# EAGLE design phone-hub (EAGLE 5.06)
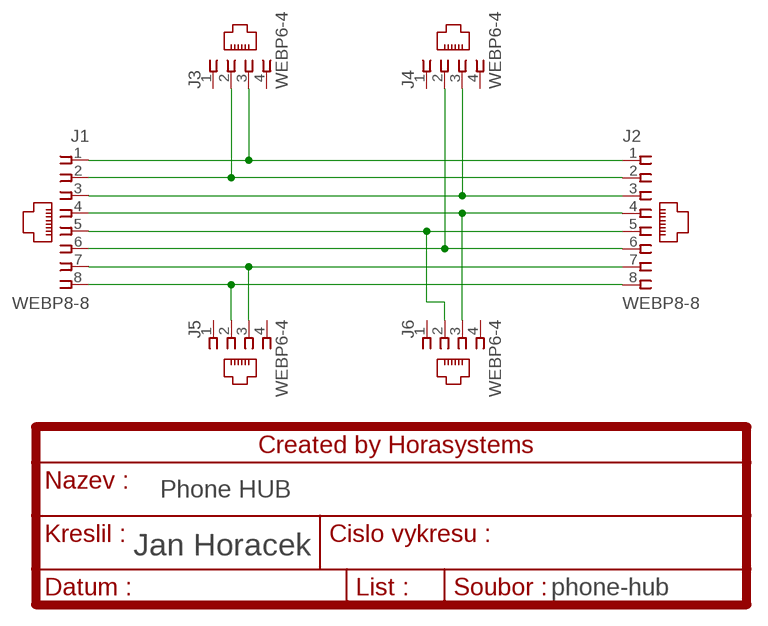
[diagram p0: schematic, sheet 1]

## Parts
J1  WEBP8-8  [WEBP8-8]
J2  WEBP8-8  [WEBP8-8]
J3  WEBP6-4  [WEBP6-4]
J4  WEBP6-4  [WEBP6-4]
J5  WEBP6-4  [WEBP6-4]
J6  WEBP6-4  [WEBP6-4]

## Nets
N$1: J1.1 J2.1 J3.3
N$2: J1.2 J2.2 J3.2
N$3: J1.3 J2.3 J4.3
N$4: J1.4 J2.4 J6.3
N$6: J1.6 J2.6 J4.2
N$7: J1.5 J2.5 J6.2
N$8: J1.8 J2.8 J5.2
N$9: J1.7 J2.7 J5.3
Unconnected: J3.1 J3.4 J4.1 J4.4 J5.1 J5.4 J6.1 J6.4

## Notes on the sheet
- Phone HUB

## Library data of the parts
J1 J2 = con-malina:WEBP8-8
J3-J6 = con-malina:WEBP6-4

## Board
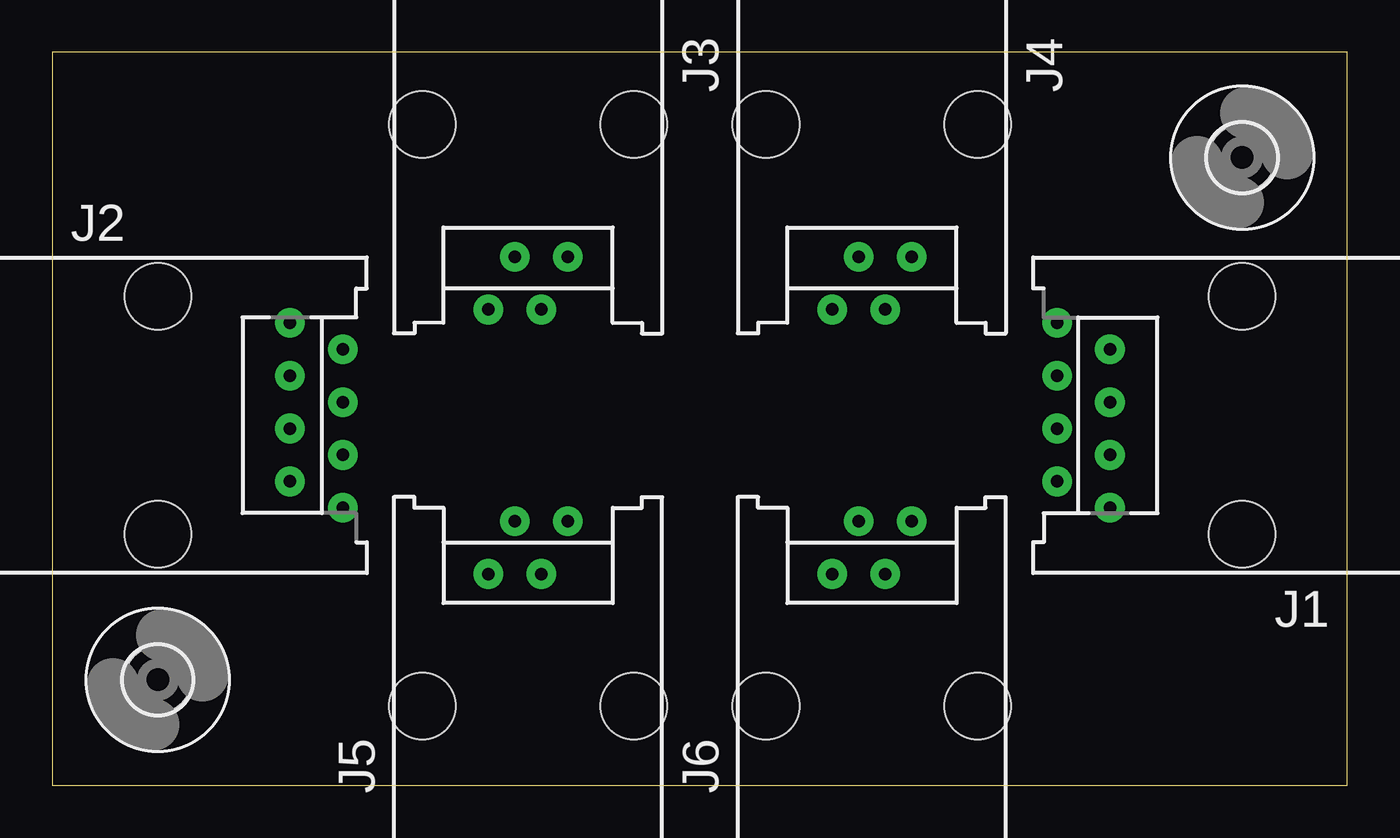
[diagram p1: board, top side]
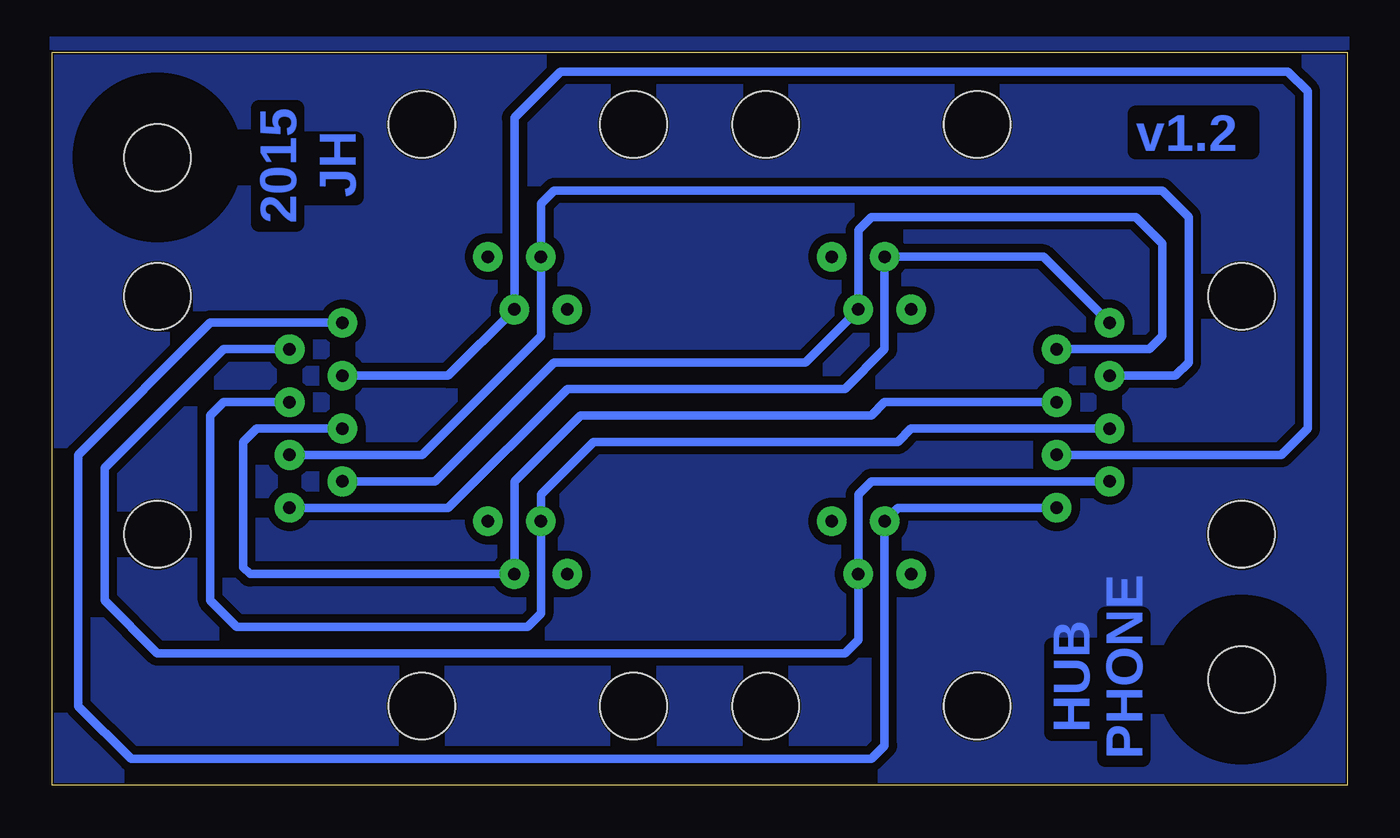
[diagram p2: board, bottom side, seen from below]

Size 62.21 x 35.23 mm. Coordinates in mm from the lower left corner, seen from the top.
Outline: 0,0 62.21,0 62.21,35.23 0,35.23 0,0
Copper layers (1*16): Top 0.036mm / dielectric 1.5011mm / Bottom 0.0356mm
Design rules "EBT_fotocesta_H *": minimum track width 0.3mm, minimum drill 0.6mm, track to track 0.4mm, track to pad 0.5mm, pad to pad 0.3mm, via to via 0.5mm, smd to smd 0mil, copper to edge 0.1mm, drill to drill 0.5mm, minimum pad ring 0.3mm, minimum via ring 0.4mm, stop-mask expansion 0mil, vias tented up to drill 0mil, thermal gap 1mm

### Footprints (pad centres in the part's own frame; a part is rotated, then mirrored left to right if it is on the bottom)
WEBP8-8 = drill 0.6 pad 1.422: 1 -4.445,6.35; 2 -3.175,8.89; 3 -1.905,6.35; 4 -0.635,8.89; 5 0.635,6.35; 6 1.905,8.89; 7 3.175,6.35; 8 4.445,8.89 | hole 3.2: -5.715,0; 5.715,0
WEBP6-4 = drill 0.6 pad 1.422: 1 -1.905,6.35; 2 -0.635,8.89; 3 0.635,6.35; 4 1.905,8.89 | hole 3.2: -5.08,0; 5.08,0
3,2 = hole 3.2: 0,0

### Placement (x,y rotation side)
J1  57.15,17.78 90 top
J2  5.08,17.78 270 top
J3  22.86,31.75 180 top
J4  39.37,31.75 180 top
J5  22.86,3.81 0 top
J6  39.37,3.81 0 top
U$1  [3,2]  5.08,5.08 0 top
U$2  [3,2]  57.15,30.16 0 top

### Tracks (layer width: path | path; a pad name or v marks a point on that pad's centre or on a via)
GND
  pour Bottom (no thermals): 0,0 0,35.56 62.23,35.56 62.23,0
N$1
  Bottom 0.406: J2.1 14.61,25.4 J3.3 22.23,20.95 24.13,19.05 37.47,19.05 43.18,13.34 J1.1
N$2
  Bottom 0.406: J2.2 9.53,20.95 8.89,21.59 8.89,26.04 10.16,27.3 22.86,27.3 23.5,26.67 J3.2 26.04,20.32 38.1,20.32 43.81,14.61 J1.2
N$3
  Bottom 0.406: J2.3 8.26,19.68 7.62,20.32 7.62,27.3 8.89,28.57 38.1,28.57 38.73,27.94 J4.3 38.73,21.59 44.45,15.88 J1.3
N$4
  Bottom 0.406: J2.4 22.23,18.41 22.86,17.78 36.83,17.78 40.01,14.61 J6.3 52.7,10.16 53.02,10.48 53.02,16.51 52.39,17.14 J1.4
N$6
  Bottom 0.406: J2.6 3.17,15.88 1.91,17.14 1.91,33.34 2.86,34.29 37.78,34.29 40.01,32.07 J4.2 43.18,19.68 J1.6
N$7
  Bottom 0.406: J1.5 53.98,18.41 54.61,17.78 54.61,8.89 53.34,7.62 39.37,7.62 38.73,8.26 J6.2 38.73,13.97 36.2,16.51 21.59,16.51 20.95,17.14 J2.5
N$8
  Bottom 0.406: J2.8 21.59,13.34 J5.2 22.23,1.91 22.86,1.27 58.42,1.27 60.96,3.81 60.96,15.88 54.61,22.23 J1.8
N$9
  Bottom 0.406: J2.7 22.86,14.61 23.5,13.97 J5.3 23.5,6.99 24.13,6.35 57.15,6.35 59.69,8.89 59.69,15.24 53.98,20.95 J1.7

### Text on the board
Bottom: v1.2 | JH | 2015 | HUB | PHONE